# EAGLE design MySXActuator (EAGLE 6.6.0)
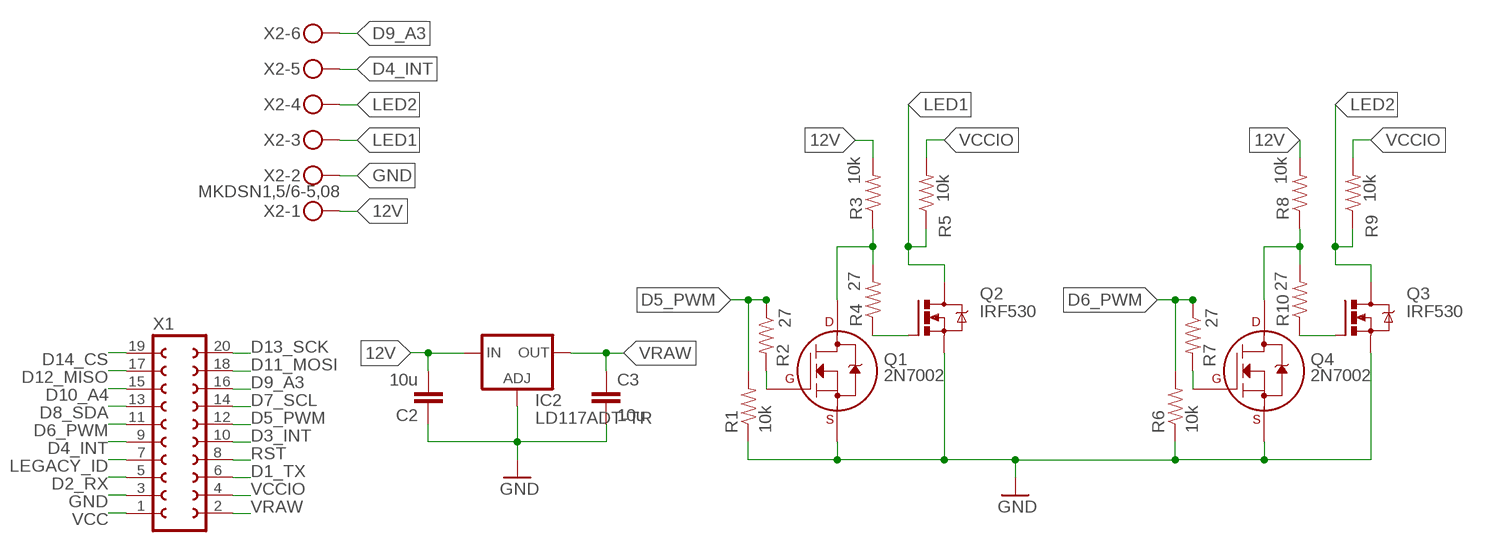
[diagram p0: schematic, sheet 1]

## Parts
C2  10u  CAP1206  [1206]
C3  10u  CAP0603-CAP  [0603-CAP]
IC2  LD117ADT-TR  [DPACK]
Q1  2N7002  2N7002_SOT23  [SOT-23]
Q2  IRF530  [TO220BV]
Q3  IRF530  [TO220BV]
Q4  2N7002  2N7002_SOT23  [SOT-23]
R1  10k  RESISTOR0603-RES  [0603-RES]
R2  27  RESISTOR0603-RES  [0603-RES]
R3  10k  RESISTOR0603-RES  [0603-RES]
R4  27  RESISTOR0603-RES  [0603-RES]
R5  10k  RESISTOR0603-RES  [0603-RES]
R6  10k  RESISTOR0603-RES  [0603-RES]
R7  27  RESISTOR0603-RES  [0603-RES]
R8  10k  RESISTOR0603-RES  [0603-RES]
R9  10k  RESISTOR0603-RES  [0603-RES]
R10  27  RESISTOR0603-RES  [0603-RES]
X1  FE10-2  [FE10-2]
X2  MKDSN1,5/6-5,08  [MKDSN1,5/6-5,08]

## Nets
12V [Power]: C2.2 IC2.3(IN) R3.2 R8.2 X2.1
D1_TX: X1.6
D2_RX: X1.5
D3_INT: X1.10
D4_INT: X1.9 X2.5
D5_PWM: R1.2 R2.1 X1.12
D6_PWM: R6.2 R7.1 X1.11
D7_SCL: X1.14
D8_SDA: X1.13
D9_A3: X1.16 X2.6
D10_A4: X1.15
D11_MOSI: X1.18
D12_MISO: X1.17
D13_SCK: X1.20
D14_CS: X1.19
GND [Power]: C2.1 C3.2 IC2.1(ADJ) Q1.2(S) Q2.S Q3.S Q4.2(S) R1.1 R6.1 X1.3 X2.2
LED1 [led power]: Q2.D R5.1 X2.3
LED2 [led power]: Q3.D R9.1 X2.4
LEGACY_ID: X1.7
N$2: Q4.1(G) R7.2
N$3: Q4.3(D) R8.1 R10.2
N$4 [Power]: Q3.G R10.1
N$11: Q1.1(G) R2.2
N$12: Q1.3(D) R3.1 R4.2
N$13 [Power]: Q2.G R4.1
RST: X1.8
VCC [Power]: X1.1
VCCIO [Power]: R5.2 R9.2 X1.4
VRAW [Power]: C3.1 IC2.4(OUT) X1.2

## Library data of the parts
C2 C3 = SparkFun-Passives:CAP: Capacitor Standard 0603 ceramic capacitor, and 0.1" leaded capacitor.
IC2 = v-reg:LD117A?*: Low drop fixed and adjustable positive voltage regulators 1 A Source: http://www.st.com/stonline/products/literature/ds/7194/ld1117axx.pdf
Q1 Q4 = transistors:2N700*: 2N7000, 2N7002, NDS7002A N-channel enhancement mode MOSFET
Q2 Q3 = transistor-power:IRF530: HEXFET Power MOSFET
R1-R10 = SparkFun-Passives:RESISTOR: Resistor Basic schematic elements and footprints for 0603, 1206, and PTH resistors.
X1 = my-con-lsta:FE10-2: FEMALE HEADER; OC_FARNELL: unknown; OC_NEWARK: unknown
X2 = con-phoenix-508:MKDSN1,5/6-5,08: MKDSN 1,5/ 6-5,08 Printklemme Nennstrom: 13,5 A Nennspannung: 250 V Rastermaß: 5,08 mm Polzahl: 6 Anschlussart: Schraubanschluss Montage: Löten Anschlussrichtung Leiter/Platine: 0 ° Artikelnummer: 1729160 Source: http://eshop.phoenixcontact.com .. 1729160.pdf

## Net classes
0 default: width 0.305 mm, drill 0.406 mm, clearance 0.229 mm
1 Power: width 0.61 mm, drill 0.406 mm, clearance 0.229 mm
2 led power: width 1.524 mm, drill 0.406 mm, clearance 0.229 mm

## Board
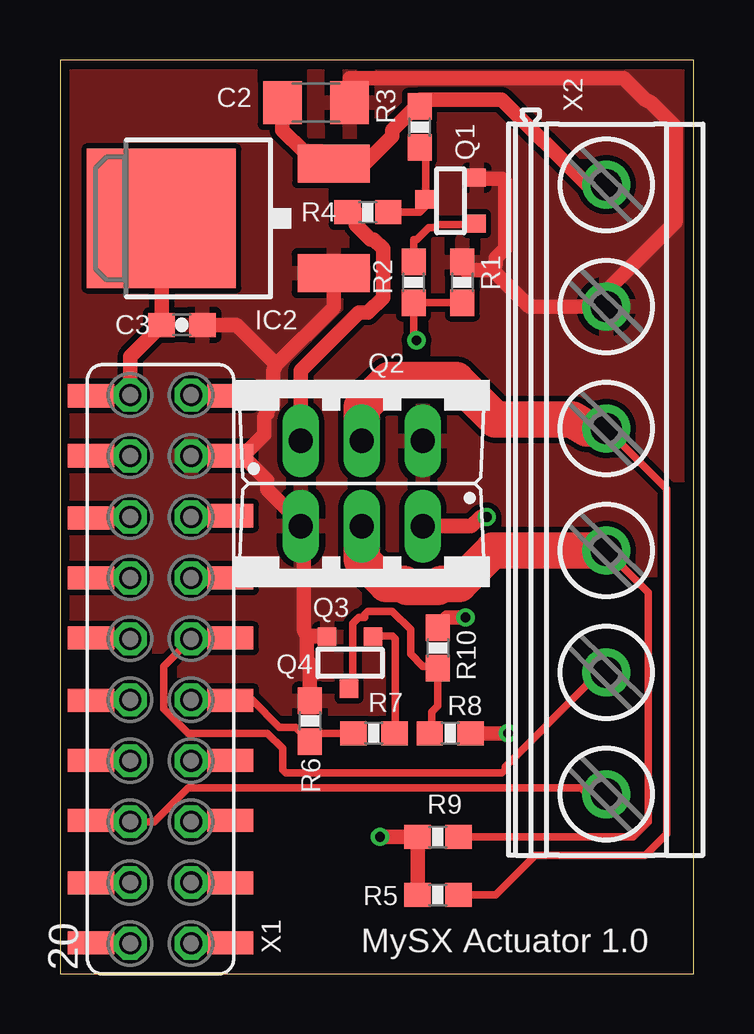
[diagram p1: board, top side]
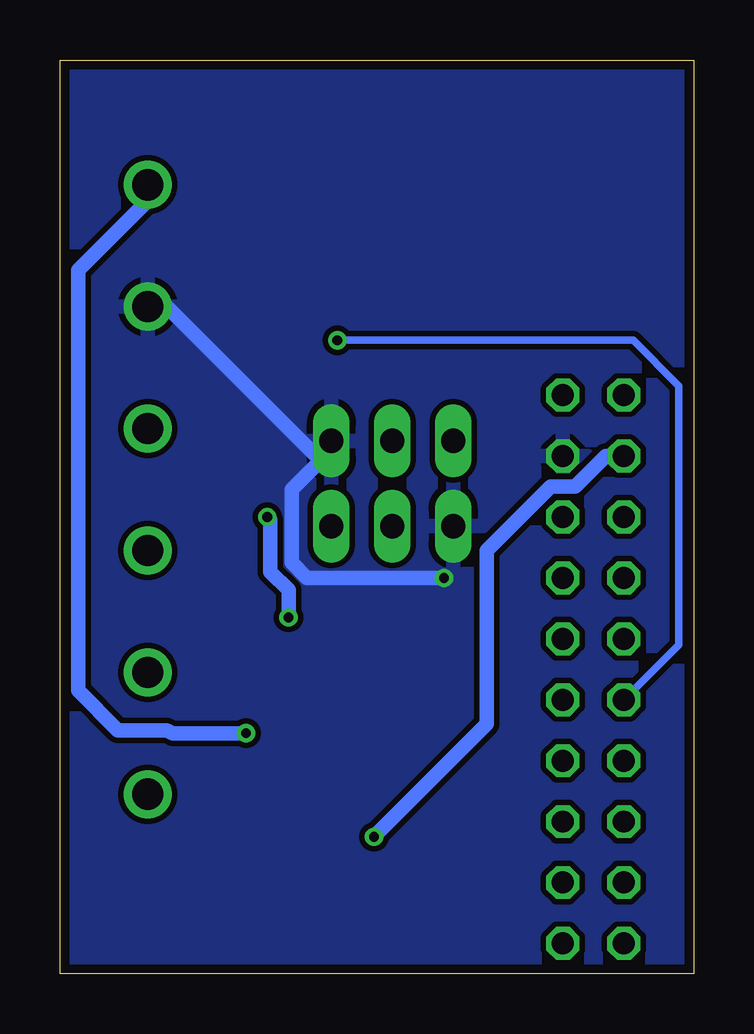
[diagram p2: board, bottom side, seen from below]

Size 26.42 x 38.1 mm. Coordinates in mm from the lower left corner, seen from the top.
Outline: 0,0 26.42,0 26.42,38.1 0,38.1 0,0
Copper layers (1*16): Top 0.0356mm / dielectric 1.5011mm / Bottom 0.0356mm
Design rules "PCBs_io *": minimum track width 9mil, minimum drill 13mil, track to track 9mil, track to pad 9mil, pad to pad 9mil, via to via 9mil, smd to smd 9mil, copper to edge 15mil, drill to drill 9mil, minimum pad ring 7mil, minimum via ring 7mil, stop-mask expansion 3mil, vias tented up to drill 0mil, thermal gap 10mil

### Footprints (pad centres in the part's own frame; a part is rotated, then mirrored left to right if it is on the bottom)
1206 = smd 1.6 x 1.8: 1 -1.4,0; 2 1.4,0
0603-CAP = smd 1.1 x 1: 1 -0.85,0; 2 0.85,0
DPACK = smd 1.6 x 3: 1 -2.28,-4.8; 3 2.28,-4.8 | smd 5.8 x 6.2: 4 0,2.38
SOT-23 = smd 0.762 x 0.762: 1 -0.979,-1.101; 2 0.94,-1.101; 3 0.025,1.067
TO220BV = drill 1.016 long: D 0,-2.54; G -2.54,-2.54; S 2.54,-2.54
0603-RES = smd 1.1 x 1: 1 -0.85,0; 2 0.85,0
FE10-2 = drill 0.914 octagon: 1 -11.43,1.27; 2 -11.43,-1.27; 3 -8.89,1.27; 4 -8.89,-1.27; 5 -6.35,1.27; 6 -6.35,-1.27; 7 -3.81,1.27; 8 -3.81,-1.27; 9 -1.27,1.27; 10 -1.27,-1.27; 11 1.27,1.27; 12 1.27,-1.27; 13 3.81,1.27; 14 3.81,-1.27; 15 6.35,1.27; 16 6.35,-1.27; 17 8.89,1.27; 18 8.89,-1.27; 19 11.43,1.27; 20 11.43,-1.27 | smd 0.965 x 1.93: P$1 -8.9,2.9; P$2 -11.4,2.9; P$3 -11.4,-2.9; P$4 -8.9,-2.9; P$5 -6.4,2.9; P$6 -3.8,2.9; P$7 -1.3,2.9; P$8 1.3,2.9; P$9 3.8,2.9; P$10 6.3,2.9; P$11 8.9,2.9; P$12 11.4,2.9; P$13 -6.3,-2.9; P$14 -3.8,-2.9; P$15 -1.3,-2.9; P$16 1.3,-2.9; P$17 3.8,-2.9; P$18 6.3,-2.9; P$19 8.9,-2.9; P$20 11.4,-2.9
MKDSN1,5/6-5,08 = drill 1.3 pad 2: 1 -12.7,0.025; 2 -7.62,0.025; 3 -2.54,0.025; 4 2.54,0.025; 5 7.62,0.025; 6 12.7,0.025

### Placement (x,y rotation side)
C2  10.67,36.32 180 top
C3  5.08,27.05 0 top
IC2  6.6,31.5 90 top
Q1  16.26,32.26 90 top
Q2  12.57,24.77 0 top
Q3  12.57,16.13 180 top
Q4  12.06,12.95 180 top
R1  16.76,28.83 270 top
R2  14.73,28.83 90 top
R3  14.99,35.31 90 top
R4  12.83,31.75 0 top
R5  15.75,3.3 180 top
R6  10.41,10.54 270 top
R7  13.08,10.03 0 top
R8  16.26,10.03 0 top
R9  15.75,5.71 180 top
R10  15.75,13.59 270 top
X1  4.19,12.7 270 top
X2  22.73,20.19 270 top

### Tracks (layer width: path | path; a pad name or v marks a point on that pad's centre or on a via)
12V  (via drill 0.41)
  Top 0.61: C2.2 9.27,35.18 10.16,34.29 10.89,34.29 IC2.3 11.68,33.78 12.7,33.78 13.84,34.92 13.84,35.18 14.73,36.07 R3.2 14.99,36.45 18.41,36.45 21.97,32.89 X2.1 | R8.2 v18.67,10.03
  Bottom 0.61: v18.67,10.03 21.72,10.03 21.97,10.16 24,10.16 25.65,11.81 25.65,29.34 22.76,32.23 X2.1
D4_INT
  Top 0.305: X1.9 4.32,12.83 4.32,11.05 5.33,10.03 8.64,10.03 9.27,9.4 9.27,8.51 9.4,8.38 18.41,8.38 18.54,8.51 18.54,8.64 21.97,12.06 21.97,12.57 X2.5
D5_PWM  (via drill 0.41)
  Top 0.305: R1.2 R2.1 14.73,26.54 v14.86,26.42
  Bottom 0.305: X1.12 0.64,13.72 0.64,24.51 2.54,26.42 v14.86,26.42
D6_PWM
  Top 0.305: R7.1 10.67,10.03 10.41,9.78 R6.2 9.82,10.29 9.14,10.29 8,11.43 X1.11
D9_A3
  Top 0.305: X1.16 3.94,6.35 5.33,7.75 21.72,7.75 21.97,7.49 X2.6
GND  (via drill 0.41)
  Top 0.61: 9.02,25.4 7.37,27.05 C3.2 | 7.62,21.59 X1.3 | IC2.1 11.4,27.79 9.02,25.4 | 9.02,25.4 8.89,25.15 8.89,23.75 8.64,23.5 8.64,23.37 8.51,23.24 8.51,22.48 7.62,21.59 | 18.03,29.34 19.56,27.81 X2.2 22.76,28.47 25.65,31.37 25.65,35.31 24.64,36.32 24.38,36.45 23.49,37.34 12.06,37.34 C2.1 | 18.03,29.34 16.89,29.34 16.76,29.46 R1.1 | 18.03,29.34 18.16,29.59 18.16,29.84 18.54,30.23 18.54,33.02 18.41,33.15 17.4,33.15 Q1.2 | 10.29,14.1 11.05,14.1 Q4.2 | 10.29,14.1 10.29,13.08 10.41,12.95 R6.1 | 10.16,16.51 10.16,18.54 Q3.S 9.91,18.92 8.64,20.19 8.64,20.57 7.62,21.59 | 10.16,16.51 10.16,14.35 10.29,14.1 | v10.41,16.51 10.16,16.51
  Bottom 0.61: v10.41,16.51 16.13,16.51 16.76,17.14 16.76,20.19 15.11,21.84 Q2.S 15.75,21.59 21.97,27.81 X2.2
  pour Bottom: 0,0 26.42,0 26.42,38.1 0,38.1
  pour Top: 0,0 26.42,0 26.42,38.1 0,38.1
LED1
  Top 0.305: R5.1 18.16,3.3 19.81,4.95 24.38,4.95 25.27,5.84 25.27,20.22 X2.3
  Top 1.524: Q2.D 12.57,23.62 13.72,24.77 16.51,24.77 18.16,23.11 21.34,23.11 21.97,22.73 X2.3
LED2
  Top 0.305: 23.49,5.71 R9.1 23.88,5.71 24.51,6.35 24.51,15.9 X2.4
  Top 1.524: Q3.D 12.57,17.27 13.59,16.26 14.35,16.26 14.48,16.13 15.75,16.13 15.88,16.26 16.64,16.26 18.03,17.65 X2.4
N$2
  Top 0.305: R7.2 13.97,10.03 13.97,13.97 13.84,14.1 13.08,14.1 Q4.1
N$3
  Top 0.305: Q4.3 12.06,11.81 12.19,11.94 12.19,14.61 12.45,14.86 12.7,14.86 12.7,14.99 12.83,15.11 13.84,15.11 14.61,14.35 14.61,13.34 15.11,12.83 15.75,12.83 R10.2 15.75,11.18 15.49,10.92 15.49,10.03 R8.1
N$4  (via drill 0.41)
  Top 0.61: Q3.G 17.15,18.67 17.53,19.05 v17.78,19.05 | v16.89,14.86 16.13,14.86 15.88,14.61 15.75,14.61 R10.1
  Bottom 0.61: v17.78,19.05 17.65,18.92 17.65,16.76 16.89,16 v16.89,14.86
N$11
  Top 0.305: Q1.1 17.27,31.24 15.75,31.24 15.62,31.11 15.37,31.11 14.86,30.61 14.73,30.61 R2.2
N$12
  Top 0.305: R4.2 14.99,31.75 15.37,32.13 15.37,32.26 15.24,32.38 | 15.24,32.38 Q1.3 | 15.24,32.38 15.24,34.2 R3.1
N$13
  Top 0.61: R4.1 12.32,31.75 12.32,31.24 12.95,30.61 13.08,30.61 13.46,30.23 13.46,28.19 12.83,27.56 12.45,27.56 10.03,25.15 Q2.G
VCCIO  (via drill 0.41)
  Top 0.61: R5.2 R9.2 v13.34,5.71
  Bottom 0.61: X1.4 3.68,21.59 4.95,20.32 5.97,20.32 8.64,17.65 8.64,10.41 v13.34,5.71
VRAW
  Top 0.61: IC2.4 C3.1 2.92,25.74 X1.2

### Text on the board
tNames: MySX Actuator 1.0